# Altium schematic sheet PC_8OUT_V0.SchDoc
size A0
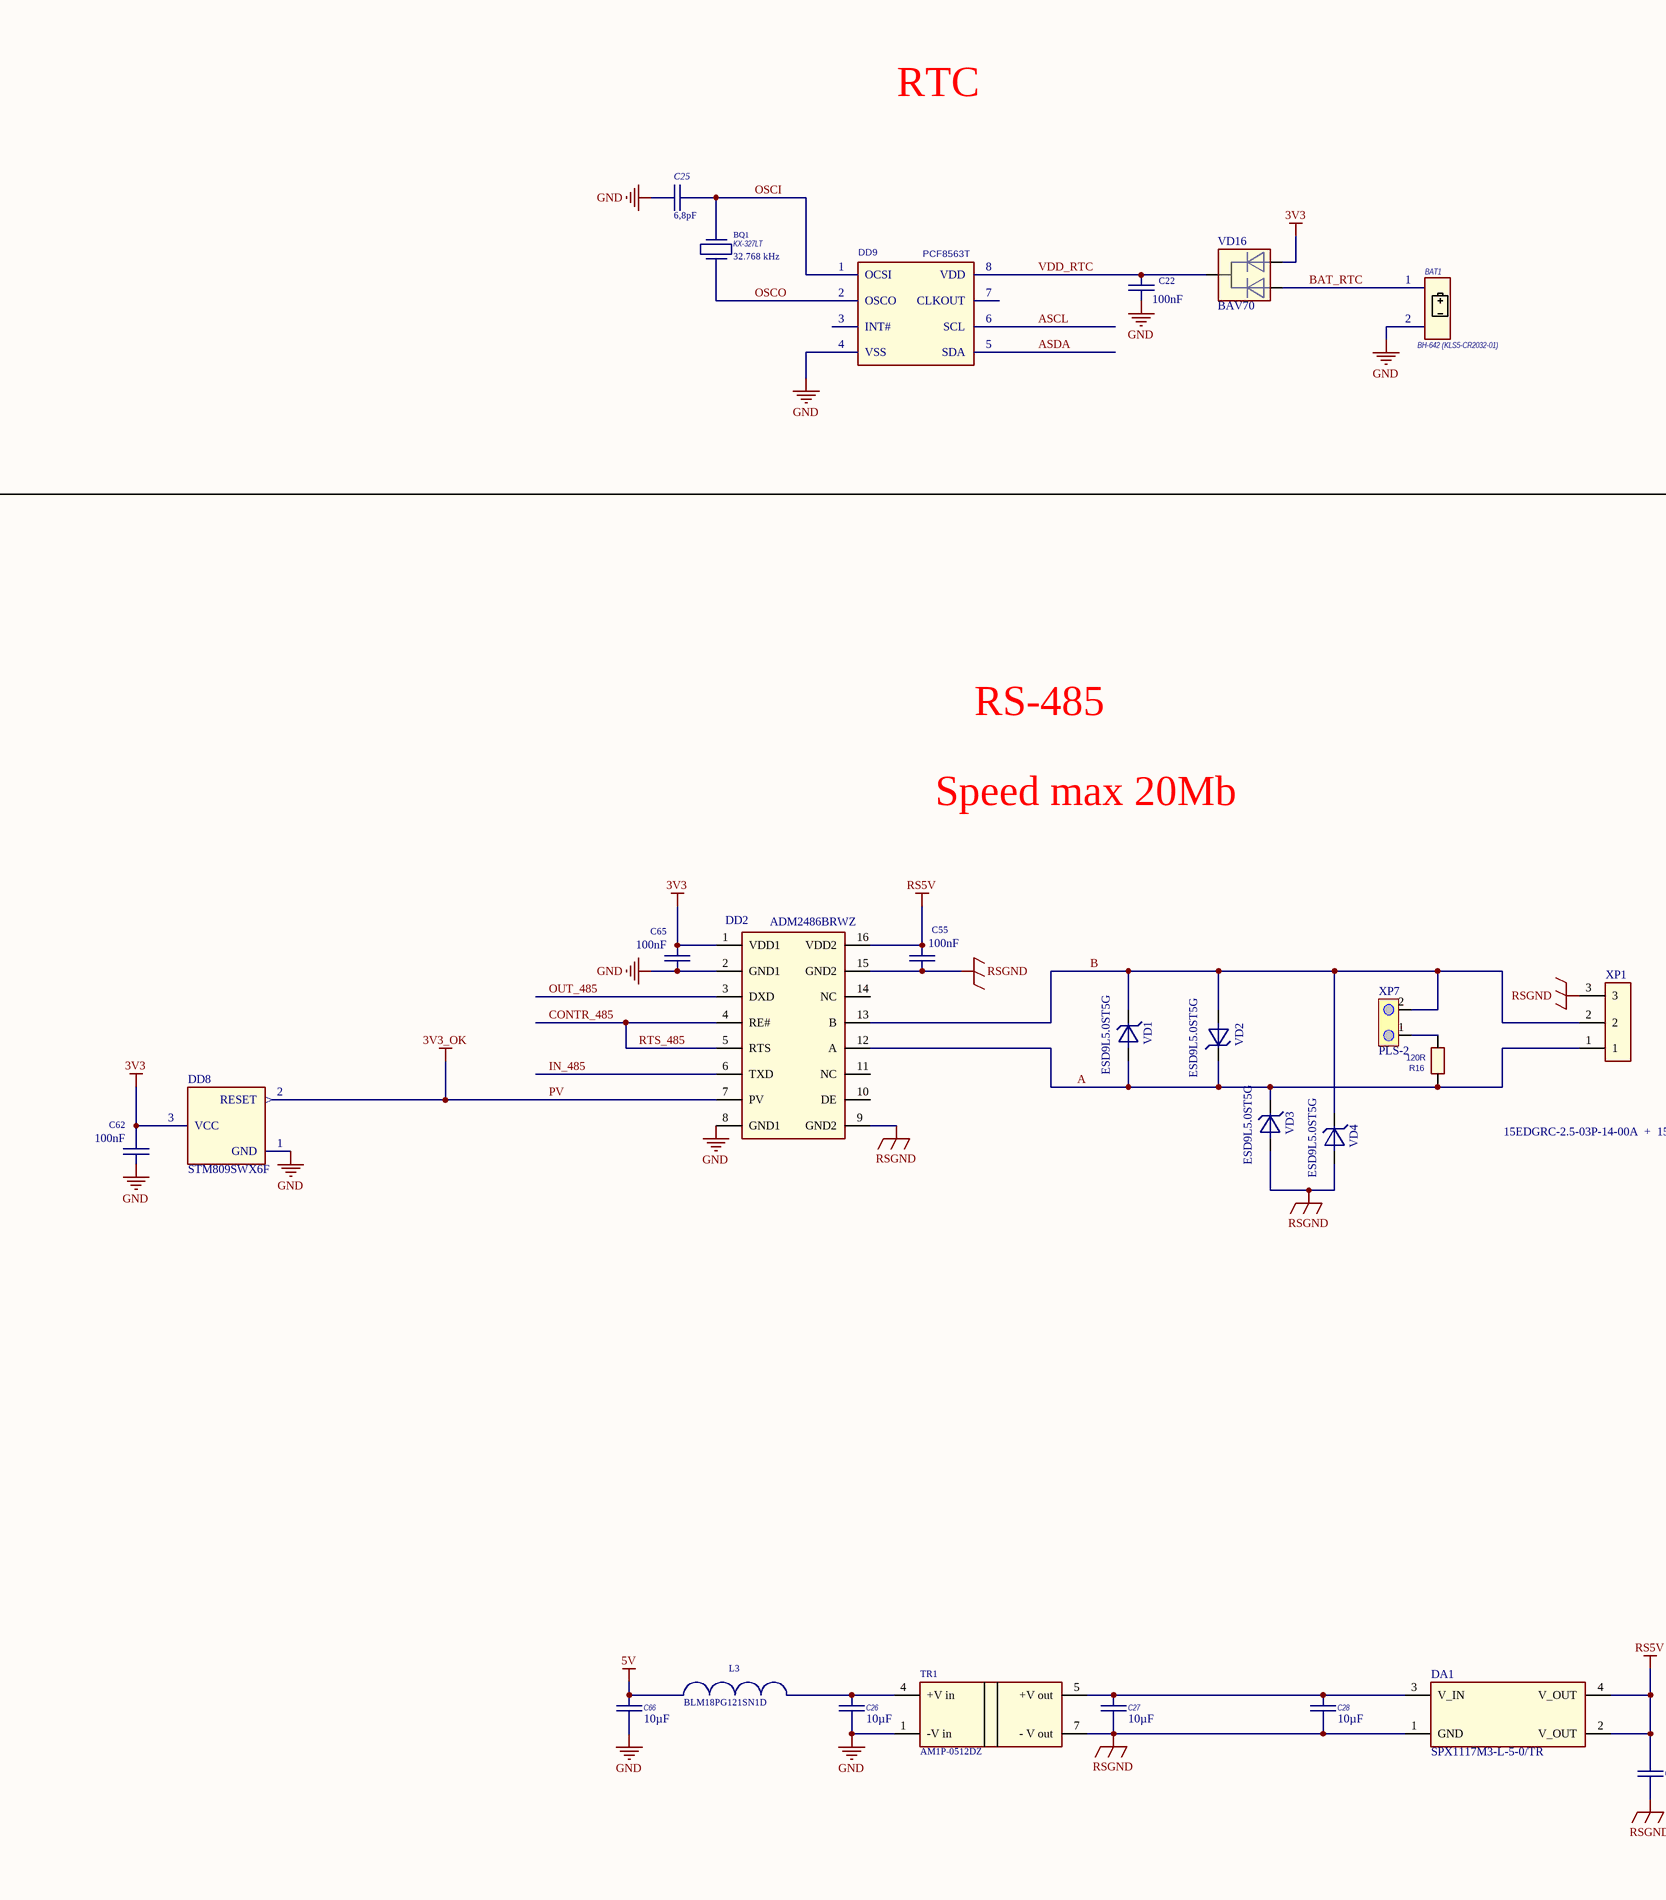
[diagram p0: PC_8OUT_V0.SchDoc, top left]
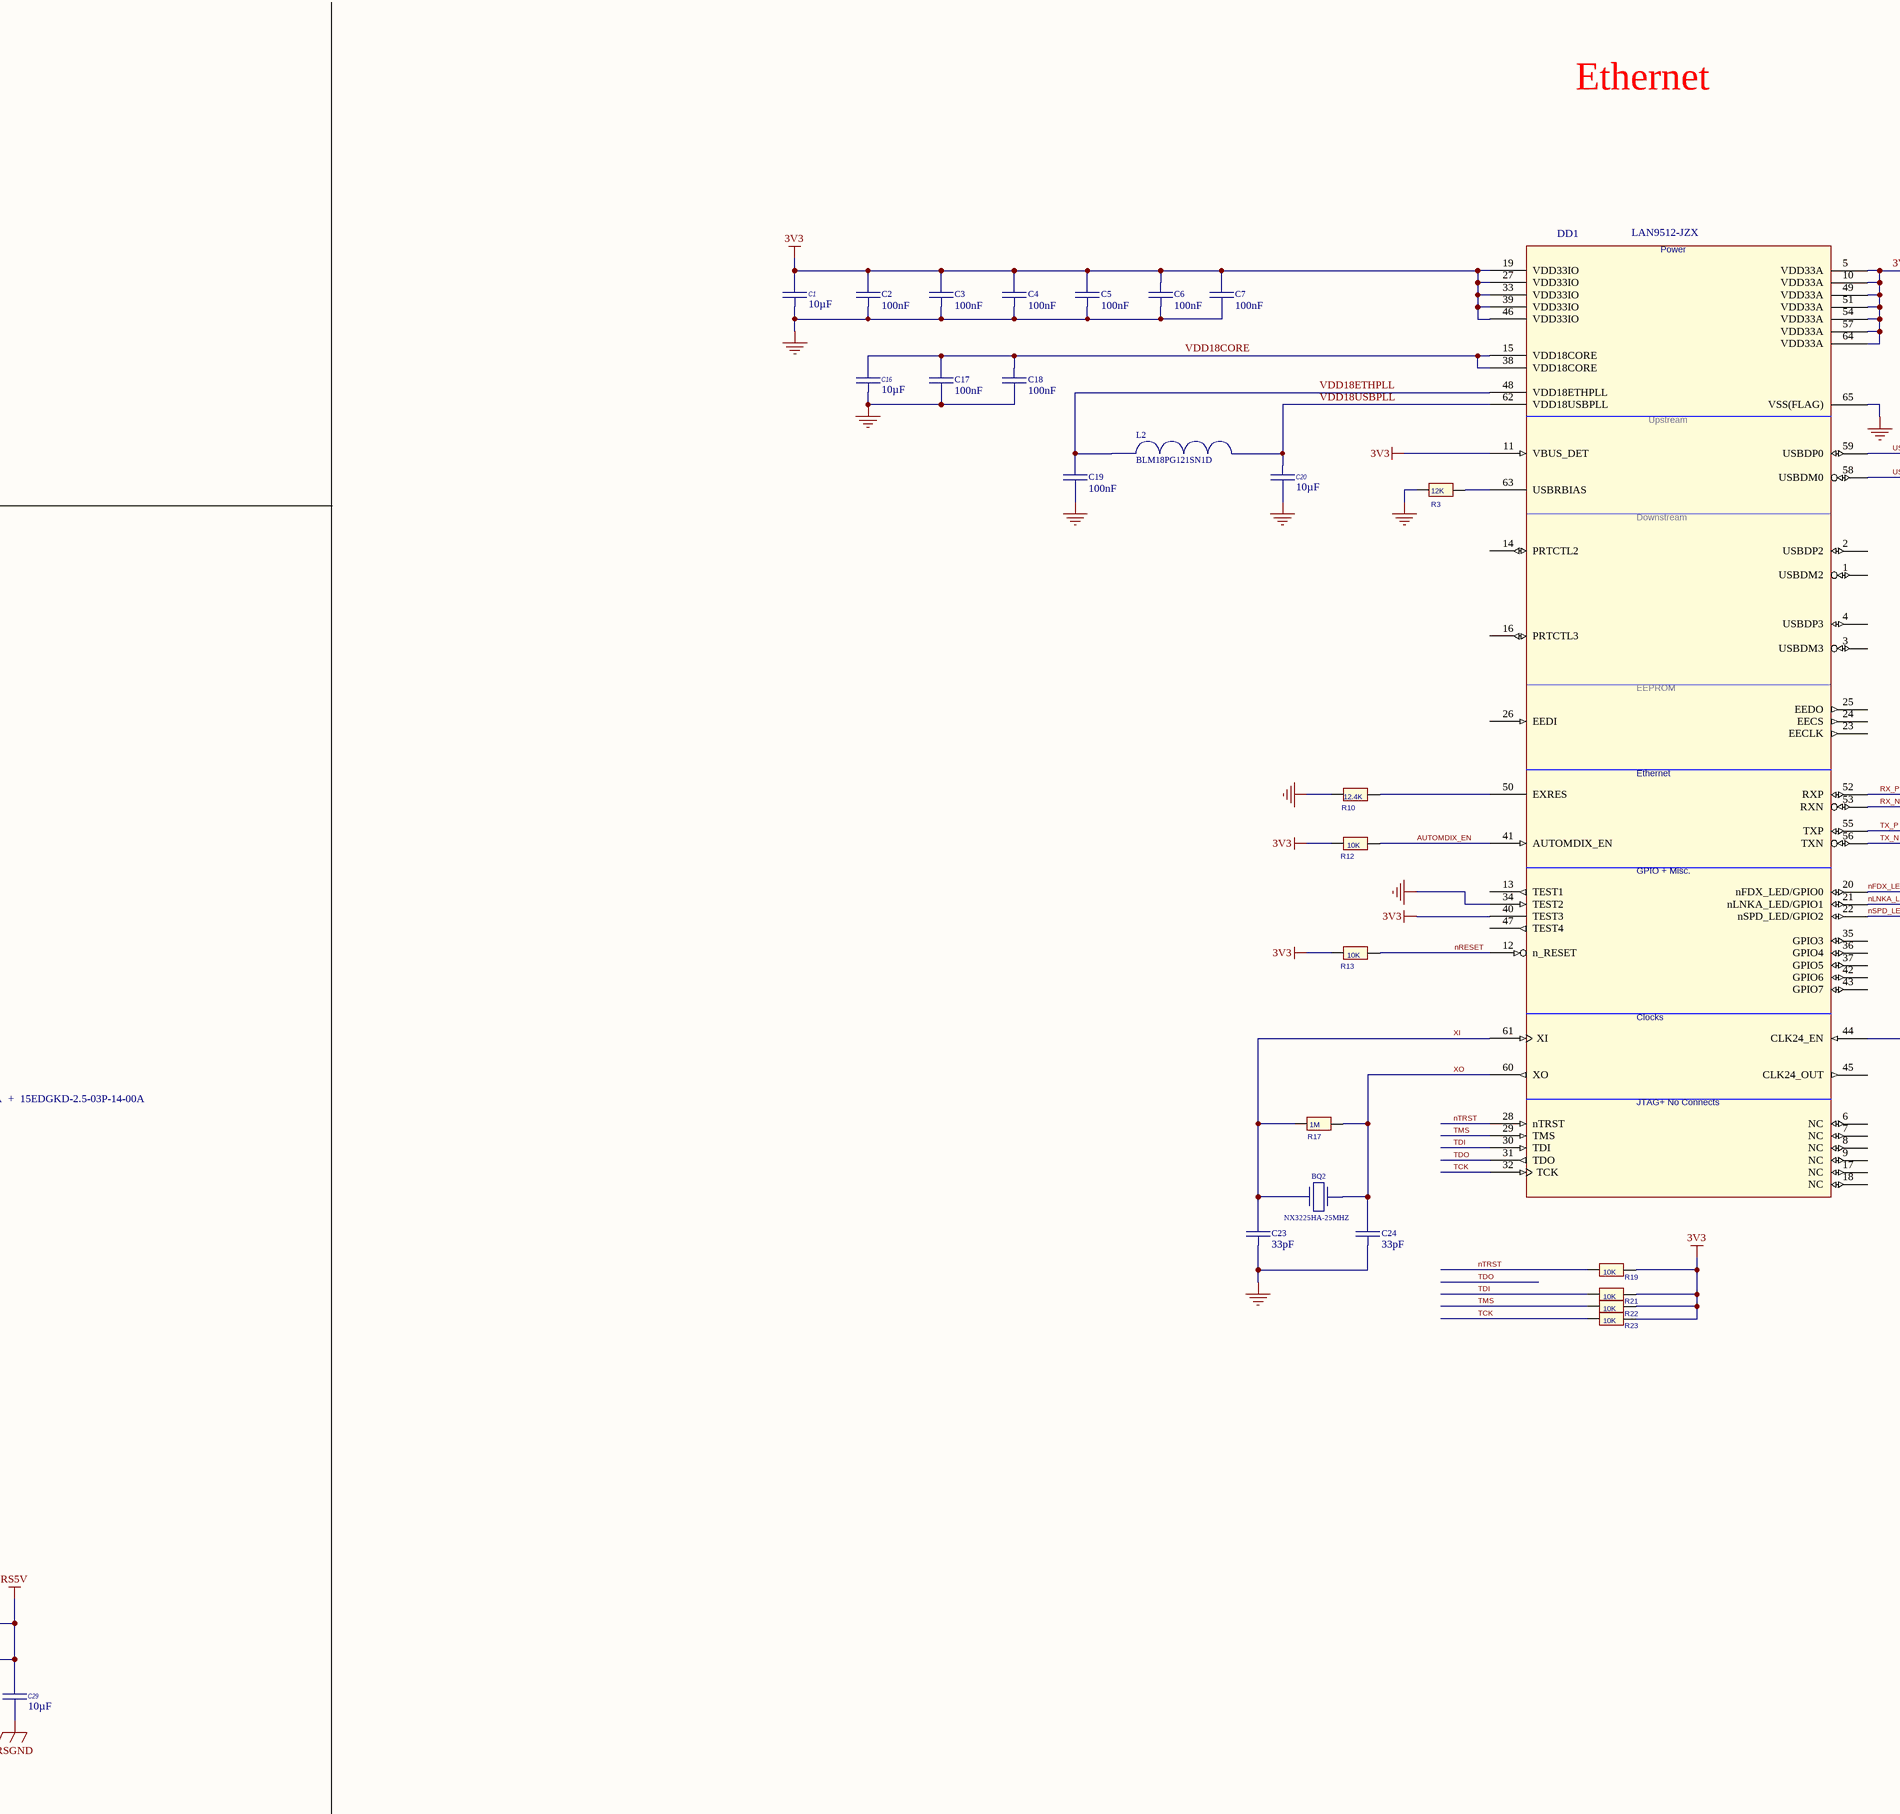
[diagram p1: PC_8OUT_V0.SchDoc, top middle]
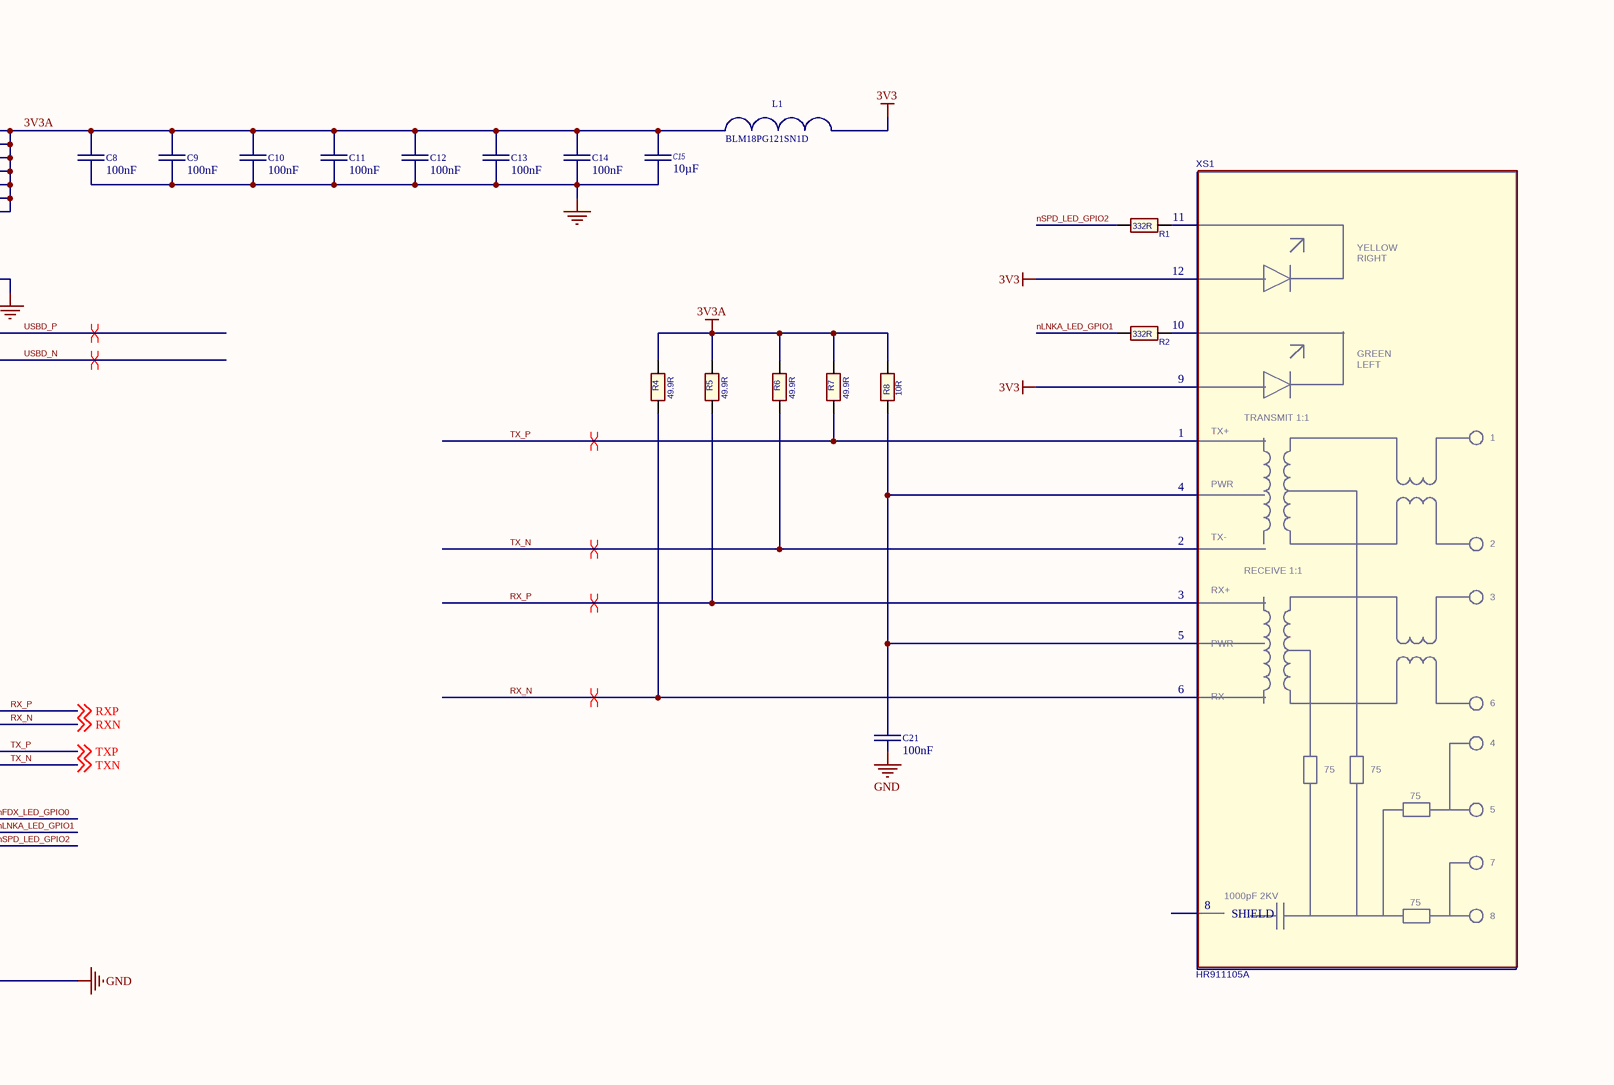
[diagram p2: PC_8OUT_V0.SchDoc, top right]
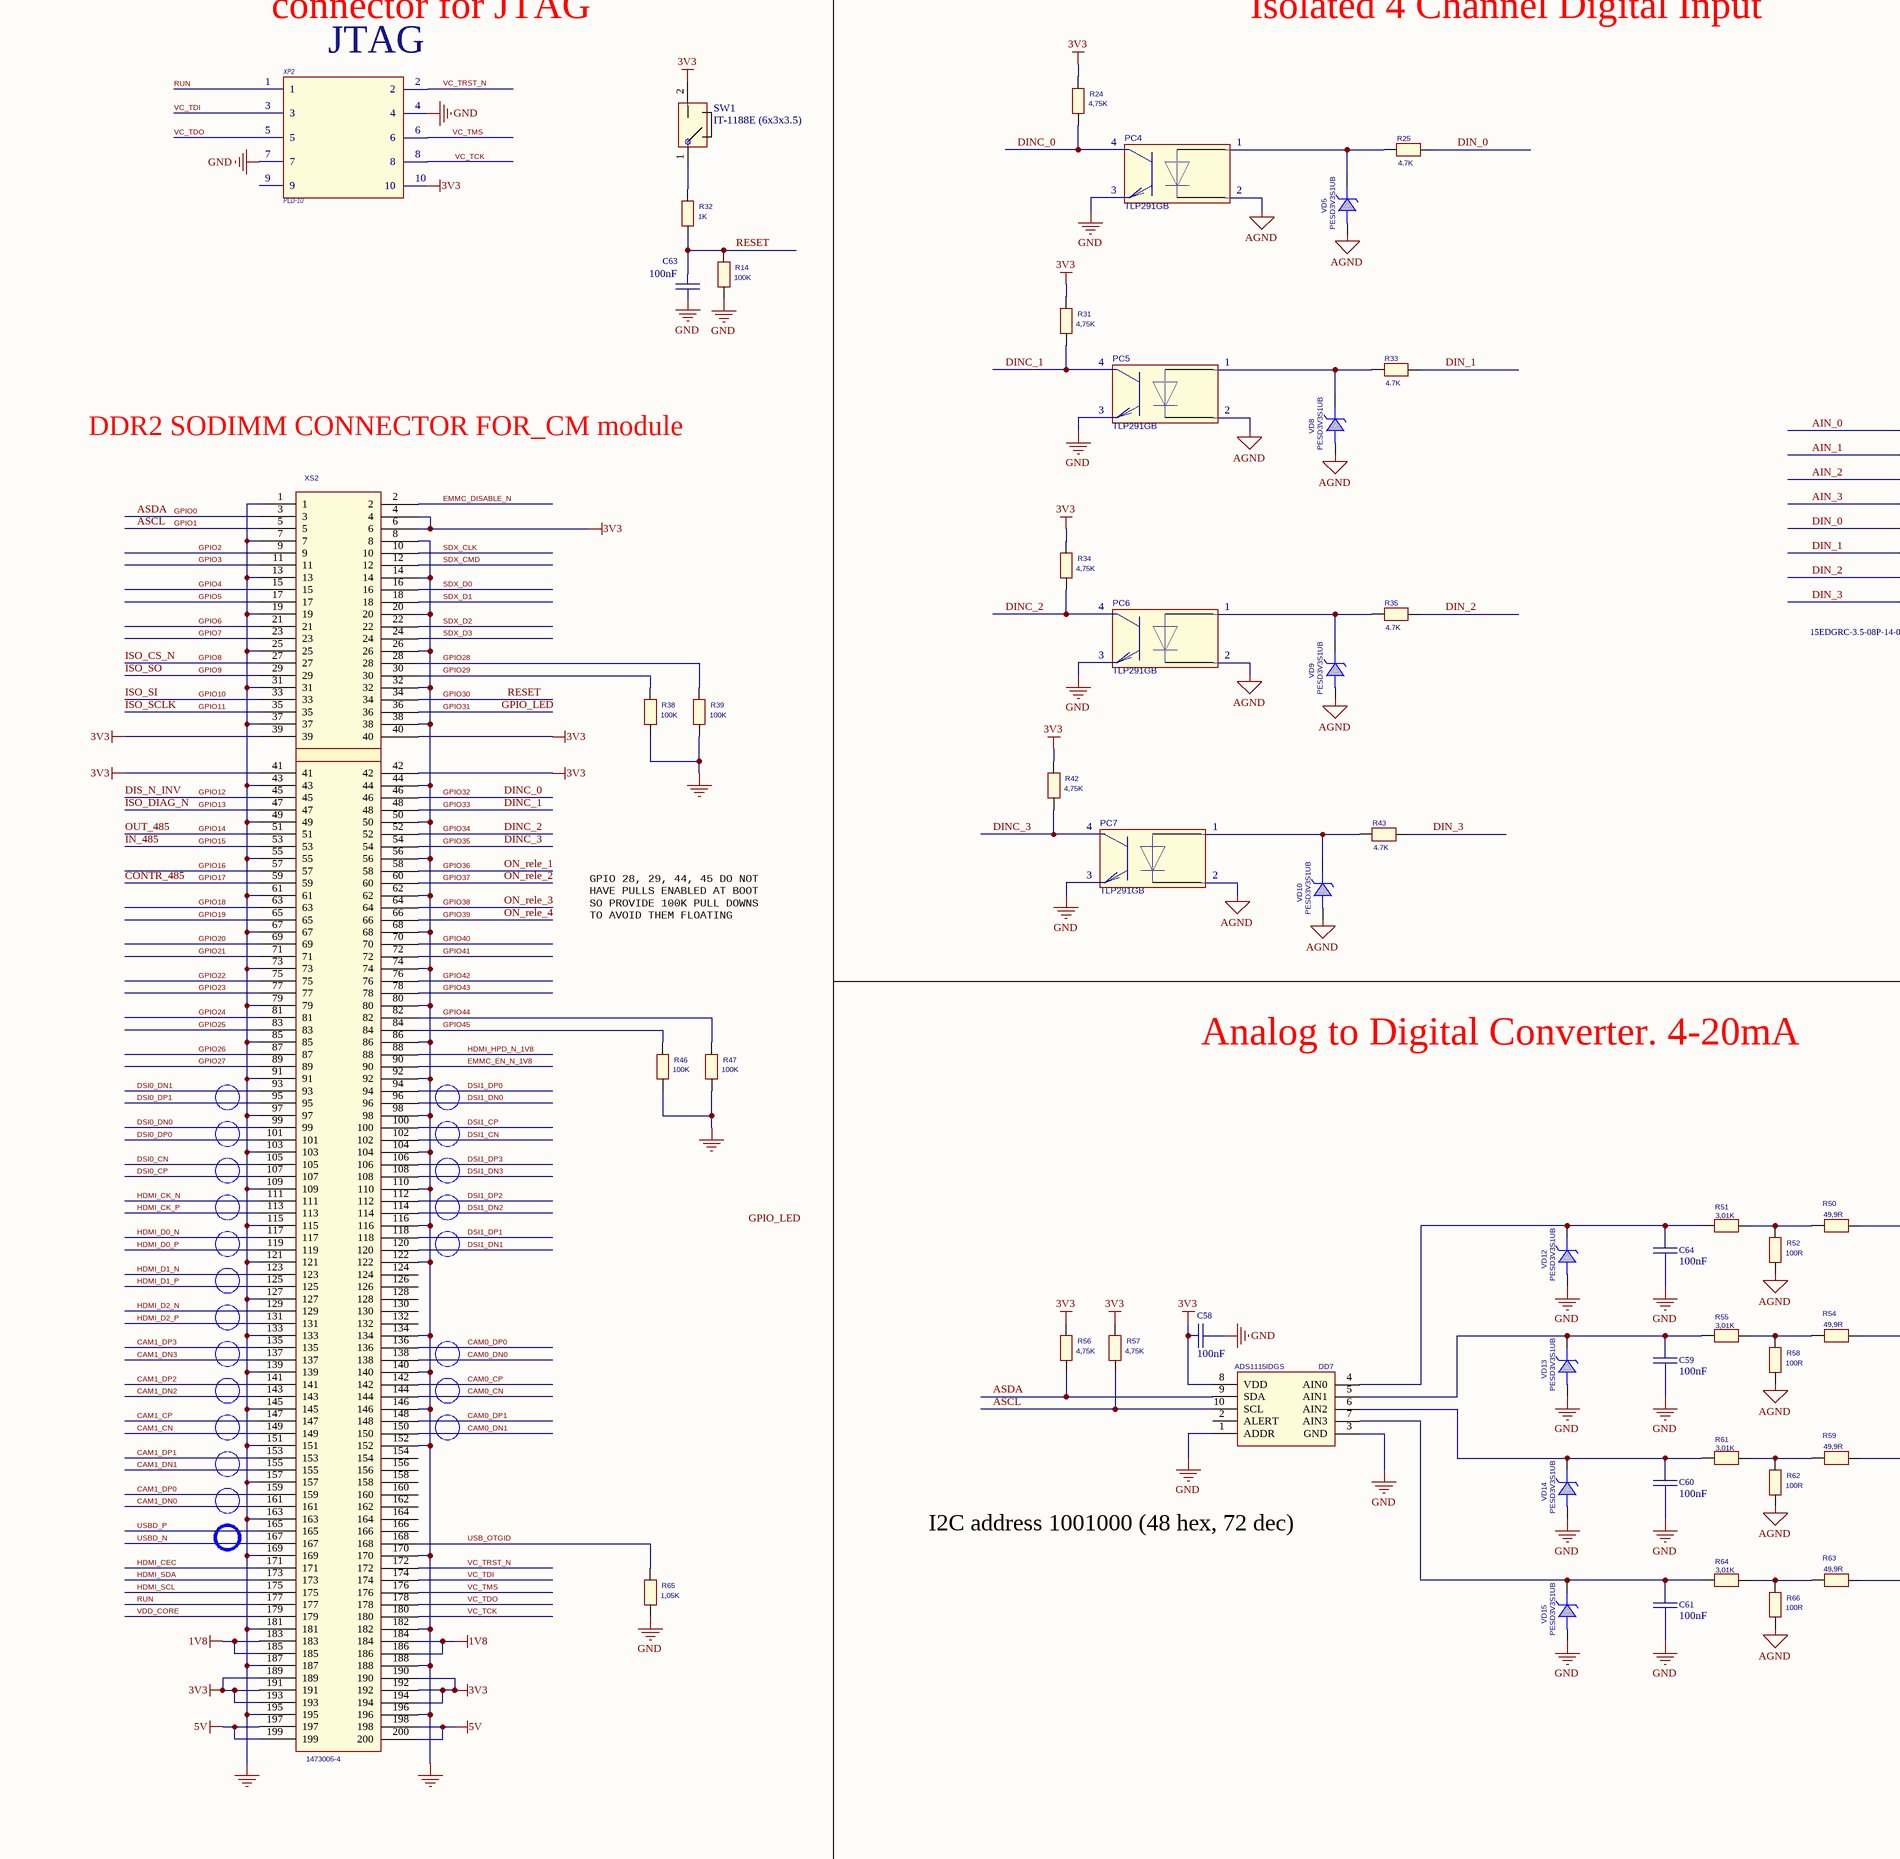
[diagram p3: PC_8OUT_V0.SchDoc, bottom left]
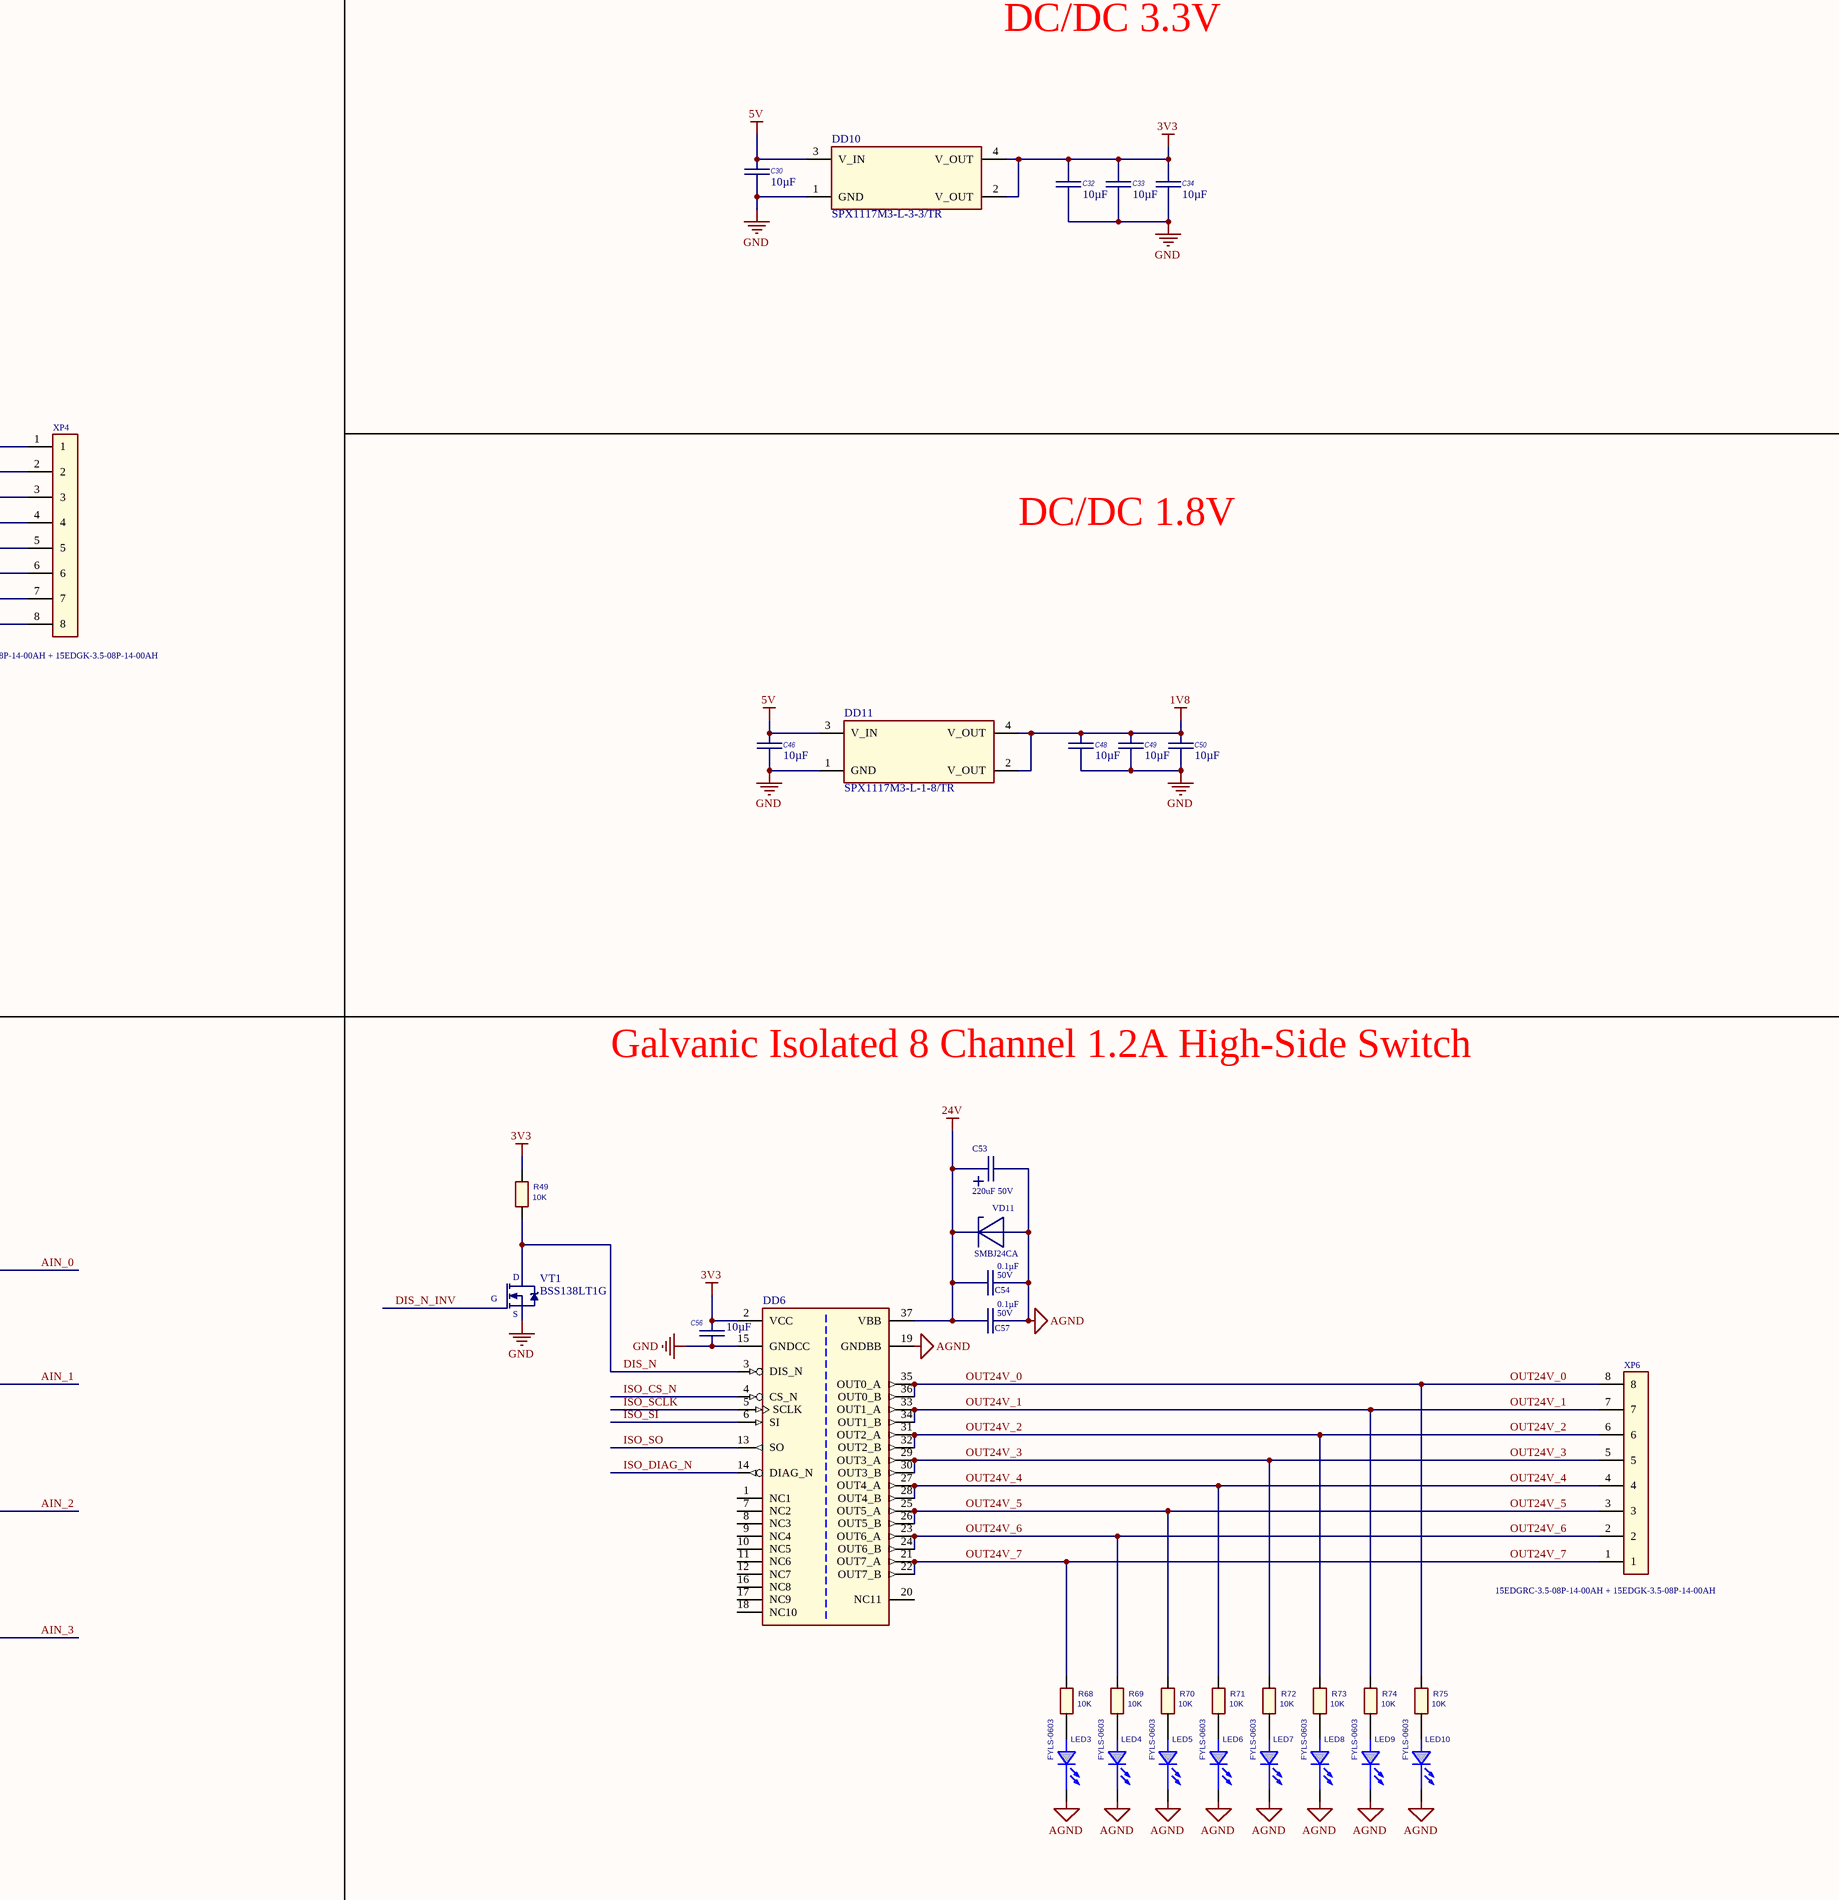
[diagram p4: PC_8OUT_V0.SchDoc, bottom middle]
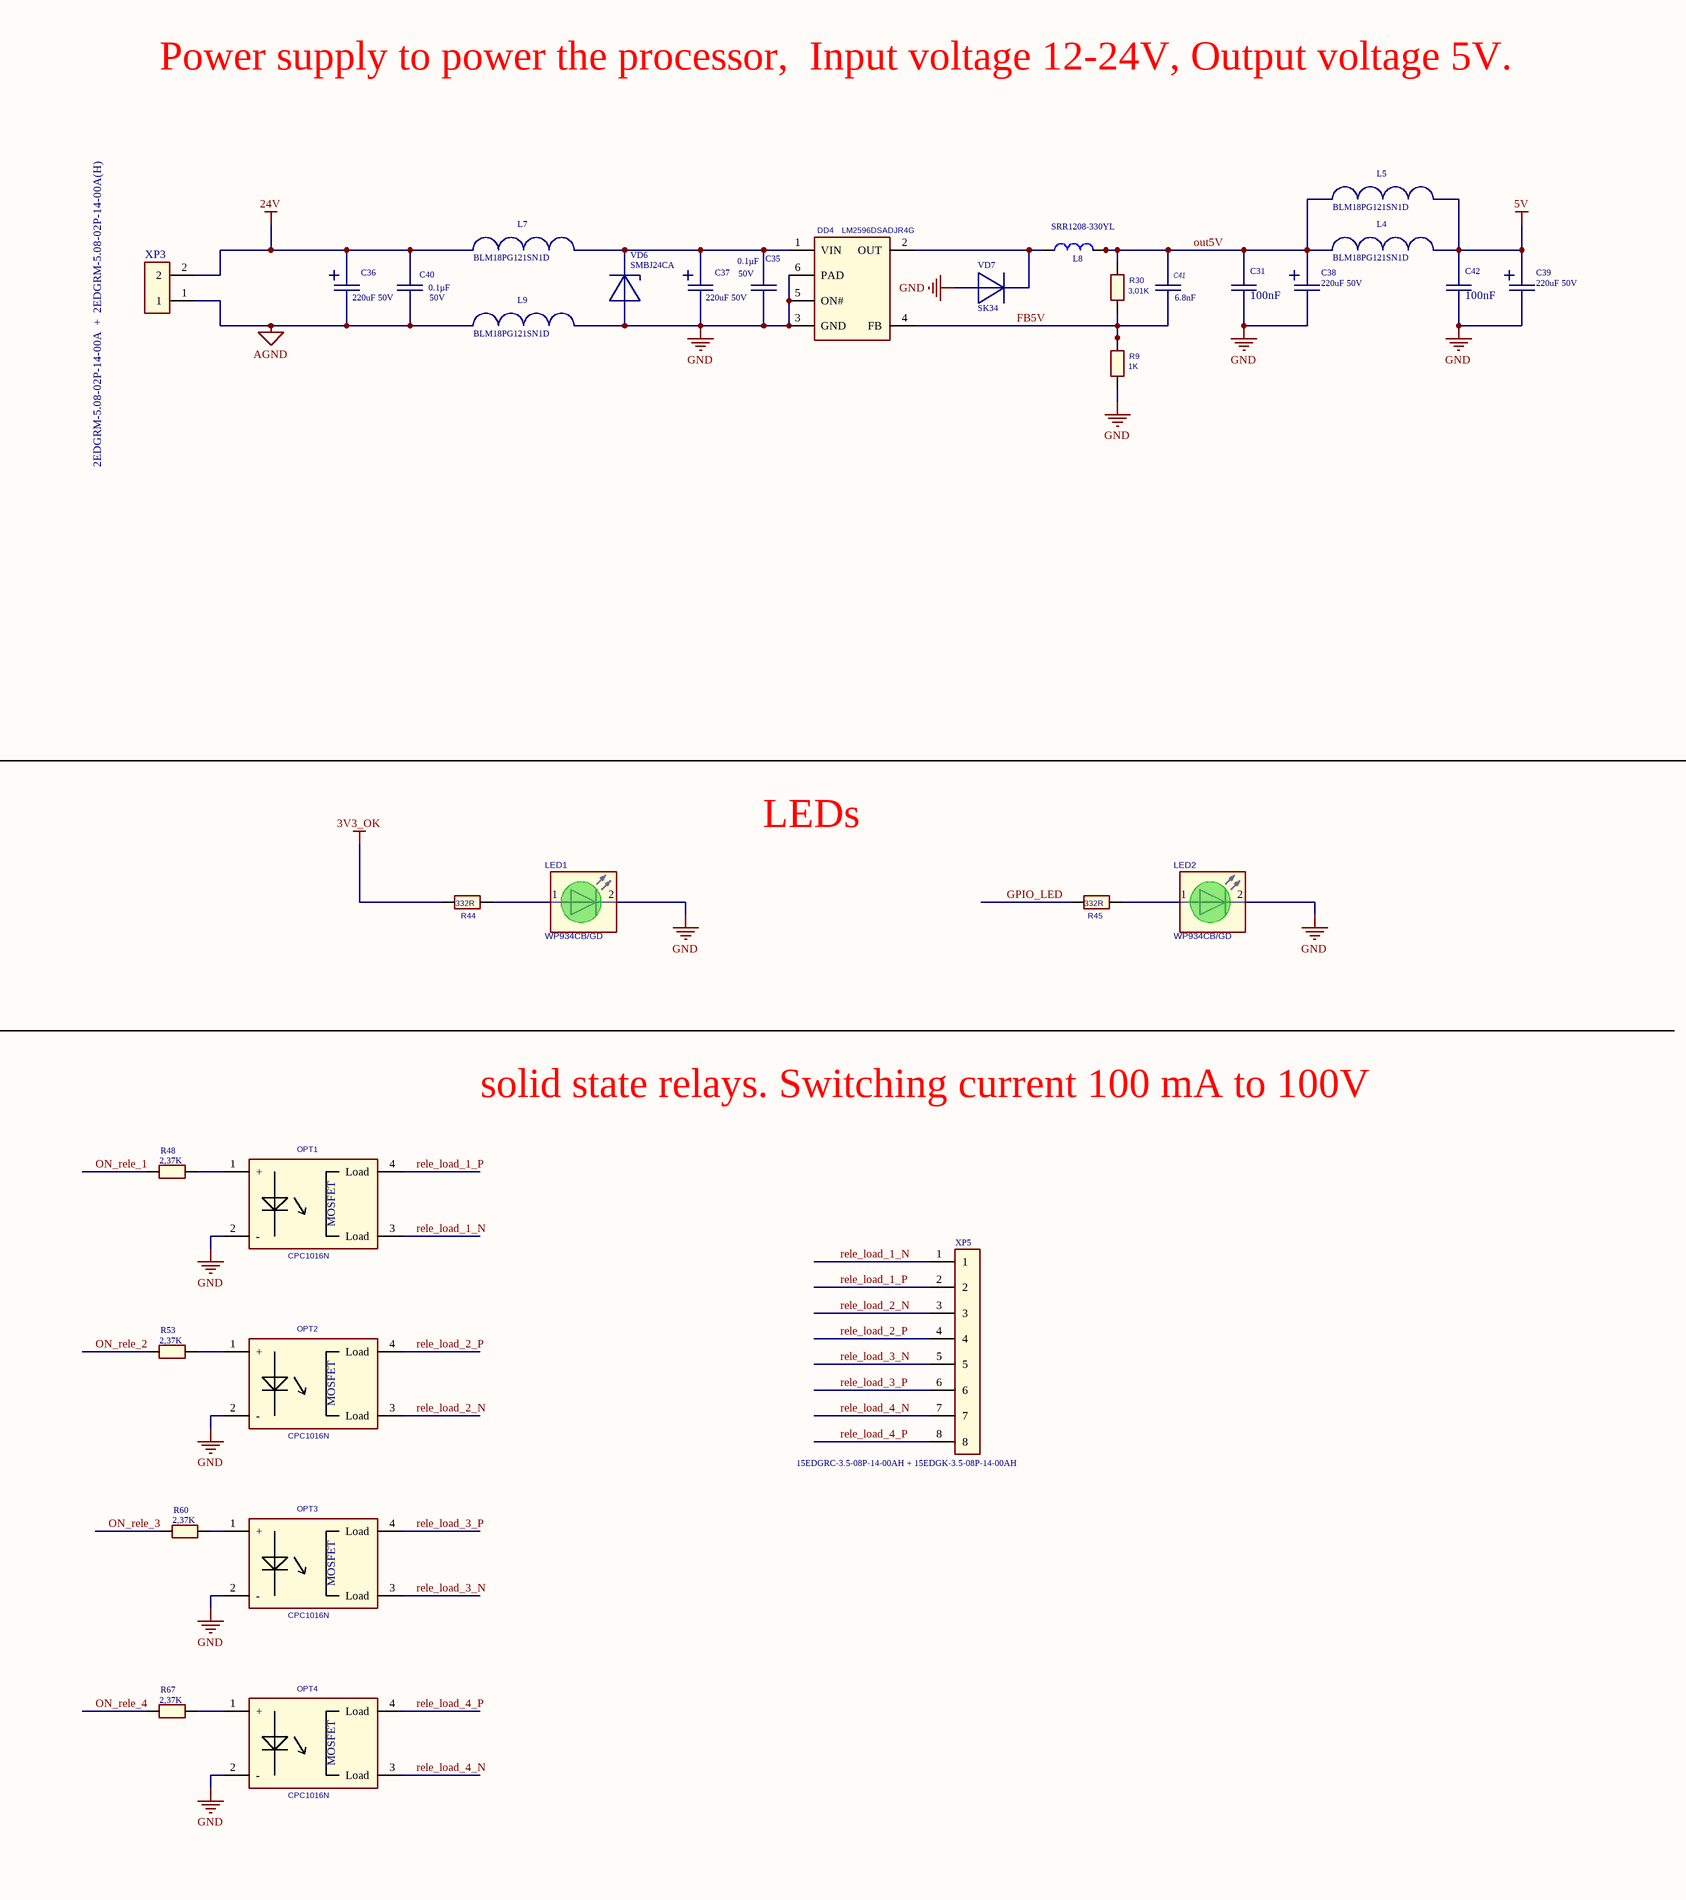
[diagram p5: PC_8OUT_V0.SchDoc, bottom right]

## Parts
BAT1  BH-642 (KLS5-CR2032-01)  [BAT_HOLD_2032]
BQ1  KX-327LT  [KX-327LT]
BQ2  NX3225HA-25MHZ  [3225]
C1  Capacitance: 10µF  [CAPC2012[0805]]  (hidden comment: GRM21BR61C106KE15)
C2  Capacitance: 100nF  [C0402_IPC High Density]  (hidden comment: GRM155R71C104KA88)
C3  Capacitance: 100nF  [C0402_IPC High Density]  (hidden comment: GRM155R71C104KA88)
C4  Capacitance: 100nF  [C0402_IPC High Density]  (hidden comment: GRM155R71C104KA88)
C5  Capacitance: 100nF  [C0402_IPC High Density]  (hidden comment: GRM155R71C104KA88)
C6  Capacitance: 100nF  [C0402_IPC High Density]  (hidden comment: GRM155R71C104KA88)
C7  Capacitance: 100nF  [C0402_IPC High Density]  (hidden comment: GRM155R71C104KA88)
C8  Capacitance: 100nF  [C0402_IPC High Density]  (hidden comment: GRM155R71C104KA88)
C9  Capacitance: 100nF  [C0402_IPC High Density]  (hidden comment: GRM155R71C104KA88)
C10  Capacitance: 100nF  [C0402_IPC High Density]  (hidden comment: GRM155R71C104KA88)
C11  Capacitance: 100nF  [C0402_IPC High Density]  (hidden comment: GRM155R71C104KA88)
C12  Capacitance: 100nF  [C0402_IPC High Density]  (hidden comment: GRM155R71C104KA88)
C13  Capacitance: 100nF  [C0402_IPC High Density]  (hidden comment: GRM155R71C104KA88)
C14  Capacitance: 100nF  [C0402_IPC High Density]  (hidden comment: GRM155R71C104KA88)
C15  Capacitance: 10µF  [CAPC2012[0805]]  (hidden comment: GRM21BR61C106KE15)
C16  Capacitance: 10µF  [CAPC2012[0805]]  (hidden comment: GRM21BR61C106KE15)
C17  Capacitance: 100nF  [C0402_IPC High Density]  (hidden comment: GRM155R71C104KA88)
C18  Capacitance: 100nF  [C0402_IPC High Density]  (hidden comment: GRM155R71C104KA88)
C19  Capacitance: 100nF  [C0402_IPC High Density]  (hidden comment: GRM155R71C104KA88)
C20  Capacitance: 10µF  [CAPC2012[0805]]  (hidden comment: GRM21BR61C106KE15)
C21  Capacitance: 100nF  [C0402_IPC High Density]  (hidden comment: GRM155R71C104KA88)
C22  Capacitance: 100nF  [C0402_IPC High Density]  (hidden comment: GRM155R71C104KA88)
C23  Capacitance: 33pF  [C0402_IPC High Density]  (hidden comment: C0402, 33pF, 50V, C0G)
C24  Capacitance: 33pF  [C0402_IPC High Density]  (hidden comment: C0402, 33pF, 50V, C0G)
C25  Capacitance: 6,8pF  [C0402_IPC High Density]  (hidden comment: C0402, 6.8pF,  50V, C0G)
C26  Capacitance: 10µF  [CAPC2012[0805]]  (hidden comment: GRM21BR61C106KE15)
C27  Capacitance: 10µF  [CAPC2012[0805]]  (hidden comment: GRM21BR61C106KE15)
C28  Capacitance: 10µF  [CAPC2012[0805]]  (hidden comment: GRM21BR61C106KE15)
C29  Capacitance: 10µF  [CAPC2012[0805]]  (hidden comment: GRM21BR61C106KE15)
C30  Capacitance: 10µF  [CAPC2012[0805]]  (hidden comment: GRM21BR61C106KE15)
C31  Capacitance: 100nF  [C0402_IPC High Density]  (hidden comment: GRM155R71C104KA88)
C32  Capacitance: 10µF  [CAPC2012[0805]]  (hidden comment: GRM21BR61C106KE15)
C33  Capacitance: 10µF  [CAPC2012[0805]]  (hidden comment: GRM21BR61C106KE15)
C34  Capacitance: 10µF  [CAPC2012[0805]]  (hidden comment: GRM21BR61C106KE15)
C35  Capacitance: 0.1µF  Voltage - Rated: 50V  [1206]  (hidden comment: C1206C104K5RAC7800)
C36  CA050M0220REG-1010  [CAP SMD 1010]  (value not drawn)
C37  CA050M0220REG-1010  [CAP SMD 1010]  (value not drawn)
C38  CA050M0220REG-1010  [CAP SMD 1010]  (value not drawn)
C39  CA050M0220REG-1010  [CAP SMD 1010]  (value not drawn)
C40  Capacitance: 0.1µF  Voltage - Rated: 50V  [1206]  (hidden comment: C1206C104K5RAC7800)
C41  Capacitance: 6.8nF  [C0402_IPC High Density]  (hidden comment: GRM155R71E682KA01)
C42  Capacitance: 100nF  [C0402_IPC High Density]  (hidden comment: GRM155R71C104KA88)
C46  Capacitance: 10µF  [CAPC2012[0805]]  (hidden comment: GRM21BR61C106KE15)
C48  Capacitance: 10µF  [CAPC2012[0805]]  (hidden comment: GRM21BR61C106KE15)
C49  Capacitance: 10µF  [CAPC2012[0805]]  (hidden comment: GRM21BR61C106KE15)
C50  Capacitance: 10µF  [CAPC2012[0805]]  (hidden comment: GRM21BR61C106KE15)
C53  CA050M0220REG-1010  [CAP SMD 1010]  (value not drawn)
C54  Capacitance: 0.1µF  Voltage - Rated: 50V  [1206]  (hidden comment: C1206C104K5RAC7800)
C55  Capacitance: 100nF  [C0402_IPC High Density]  (hidden comment: GRM155R71C104KA88)
C56  Capacitance: 10µF  [CAPC2012[0805]]  (hidden comment: GRM21BR61C106KE15)
C57  Capacitance: 0.1µF  Voltage - Rated: 50V  [1206]  (hidden comment: C1206C104K5RAC7800)
C58  Capacitance: 100nF  [C0402_IPC High Density]  (hidden comment: GRM155R71C104KA88)
C59  Capacitance: 100nF  [C0402_IPC High Density]  (hidden comment: GRM155R71C104KA88)
C60  Capacitance: 100nF  [C0402_IPC High Density]  (hidden comment: GRM155R71C104KA88)
C61  Capacitance: 100nF  [C0402_IPC High Density]  (hidden comment: GRM155R71C104KA88)
C62  Capacitance: 100nF  [C0402_IPC High Density]  (hidden comment: GRM155R71C104KA88)
C63  Capacitance: 100nF  [C0402_IPC High Density]  (hidden comment: GRM155R71C104KA88)
C64  Capacitance: 100nF  [C0402_IPC High Density]  (hidden comment: GRM155R71C104KA88)
C65  Capacitance: 100nF  [C0402_IPC High Density]  (hidden comment: GRM155R71C104KA88)
C66  Capacitance: 10µF  [CAPC2012[0805]]  (hidden comment: GRM21BR61C106KE15)
DA1  SPX1117M3-L-5-0/TR  [SOT223_N]
DD1  LAN9512-JZX  [QFN64_9X9MM_EP7P3MM]
DD2  ADM2486BRWZ  [SOIC 16 (300-mil Body Width)]
DD4  LM2596DSADJR4G  [D2PAK (TO-263-5)]
DD6  ISO1H816G  [SOP65P1420X350-37N-1-V]  (value not drawn)
DD7  ADS1115IDGS  [VSSOP10]
DD8  STM809SWX6F  [SOT-23]
DD9  PCF8563T  [SO-8_L]
DD10  SPX1117M3-L-3-3/TR  [SOT223_N]
DD11  SPX1117M3-L-1-8/TR  [SOT223_N]
L1  BLM18PG121SN1D  [INDC1608X95N]
L2  BLM18PG121SN1D  [INDC1608X95N]
L3  BLM18PG121SN1D  [INDC1608X95N]
L4  BLM18PG121SN1D  [INDC1608X95N]
L5  BLM18PG121SN1D  [INDC1608X95N]
L7  BLM18PG121SN1D  [INDC1608X95N]
L8  SRR1208-330YL  [SRR1208]
L9  BLM18PG121SN1D  [INDC1608X95N]
LED1  WP934CB/GD  [L-934SB/4GD]
LED2  WP934CB/GD  [L-934SB/4GD]
LED3  FYLS-0603  [LED 0603 (1.6X0.8X0.8)]
LED4  FYLS-0603  [LED 0603 (1.6X0.8X0.8)]
LED5  FYLS-0603  [LED 0603 (1.6X0.8X0.8)]
LED6  FYLS-0603  [LED 0603 (1.6X0.8X0.8)]
LED7  FYLS-0603  [LED 0603 (1.6X0.8X0.8)]
LED8  FYLS-0603  [LED 0603 (1.6X0.8X0.8)]
LED9  FYLS-0603  [LED 0603 (1.6X0.8X0.8)]
LED10  FYLS-0603  [LED 0603 (1.6X0.8X0.8)]
OPT1  CPC1016N  [SOP4]
OPT2  CPC1016N  [SOP4]
OPT3  CPC1016N  [SOP4]
OPT4  CPC1016N  [SOP4]
PC4  TLP291GB  [TLP292]
PC5  TLP291GB  [TLP292]
PC6  TLP291GB  [TLP292]
PC7  TLP291GB  [TLP292]
R1  332R  [RESC1005[0402]]
R2  332R  [RESC1005[0402]]
R3  12K  [RESC1005[0402]]
R4  49.9R  [RESC1005[0402]]
R5  49.9R  [RESC1005[0402]]
R6  49.9R  [RESC1005[0402]]
R7  49.9R  [RESC1005[0402]]
R8  10R  [RESC1005[0402]]
R9  1K  [RESC1005[0402]]
R10  12.4K  [RESC1005[0402]]
R12  10K  [RESC1005[0402]]
R13  10K  [RESC1005[0402]]
R14  100K  [RESC1005[0402]]
R16  120R  [RESC1005[0402]]
R17  1M  [RESC1005[0402]]
R19  10K  [RESC1005[0402]]
R21  10K  [RESC1005[0402]]
R22  10K  [RESC1005[0402]]
R23  10K  [RESC1005[0402]]
R24  4,75K  [RESC1005[0402]]
R25  4.7K  [R0805]
R30  3,01K  [RESC1005[0402]]
R31  4,75K  [RESC1005[0402]]
R32  1K  [RESC1005[0402]]
R33  4.7K  [R0805]
R34  4,75K  [RESC1005[0402]]
R35  4.7K  [R0805]
R38  100K  [RESC1005[0402]]
R39  100K  [RESC1005[0402]]
R42  4,75K  [RESC1005[0402]]
R43  4.7K  [R0805]
R44  332R  [RESC1005[0402]]
R45  332R  [RESC1005[0402]]
R46  100K  [RESC1005[0402]]
R47  100K  [RESC1005[0402]]
R48  2,37K  [RESC1005[0402]]
R49  10K  [RESC1005[0402]]
R50  49,9R  [RESC1005[0402]]
R51  3,01K  [RESC1005[0402]]
R52  100R  [RESC1005[0402]]
R53  2,37K  [RESC1005[0402]]
R54  49,9R  [RESC1005[0402]]
R55  3,01K  [RESC1005[0402]]
R56  4,75K  [RESC1005[0402]]
R57  4,75K  [RESC1005[0402]]
R58  100R  [RESC1005[0402]]
R59  49,9R  [RESC1005[0402]]
R60  2,37K  [RESC1005[0402]]
R61  3,01K  [RESC1005[0402]]
R62  100R  [RESC1005[0402]]
R63  49,9R  [RESC1005[0402]]
R64  3,01K  [RESC1005[0402]]
R65  1,05K  [RESC1005[0402]]
R66  100R  [RESC1005[0402]]
R67  2,37K  [RESC1005[0402]]
R68  10K  [RESC1005[0402]]
R69  10K  [RESC1005[0402]]
R70  10K  [RESC1005[0402]]
R71  10K  [RESC1005[0402]]
R72  10K  [RESC1005[0402]]
R73  10K  [RESC1005[0402]]
R74  10K  [RESC1005[0402]]
R75  10K  [RESC1005[0402]]
SW1  IT-1188E (6x3x3.5)  [IT-1188E (6x3x3.5)]
TR1  AM1P-0512DZ  [AM1P-Z]
VD1  ESD9L5.0ST5G  [SOD-923]
VD2  ESD9L5.0ST5G  [SOD-923]
VD3  ESD9L5.0ST5G  [SOD-923]
VD4  ESD9L5.0ST5G  [SOD-923]
VD5  PESD3V3S1UB  [SOD-523]
VD6  SMBJ24CA  [SMB]
VD7  SK34  [SMC]
VD8  PESD3V3S1UB  [SOD-523]
VD9  PESD3V3S1UB  [SOD-523]
VD10  PESD3V3S1UB  [SOD-523]
VD11  SMBJ24CA  [SMB]
VD12  PESD3V3S1UB  [SOD-523]
VD13  PESD3V3S1UB  [SOD-523]
VD14  PESD3V3S1UB  [SOD-523]
VD15  PESD3V3S1UB  [SOD-523]
VD16  BAV70  [SOT-23]
VT1  BSS138LT1G  [SOT-23]
XP1  15EDGRC-2.5-03P-14-00A  +  15EDGKD-2.5-03P-14-00A  [15EDGRC-2.5-03P-14-00A(H)]
XP2  PLD-10  [PLD-10]
XP3  2EDGRM-5.08-02P-14-00A  +  2EDGRM-5.08-02P-14-00A(H)  [2EDGRM-5.08-02P-14-00A]
XP4  15EDGRC-3.5-08P-14-00AH + 15EDGK-3.5-08P-14-00AH  [15EDGRC-3.5-06P-14-00AH]
XP5  15EDGRC-3.5-08P-14-00AH + 15EDGK-3.5-08P-14-00AH  [15EDGRC-3.5-06P-14-00AH]
XP6  15EDGRC-3.5-08P-14-00AH + 15EDGK-3.5-08P-14-00AH  [15EDGRC-3.5-06P-14-00AH]
XP7  PLS-2  [PLS-2]
XS1  HR911105A  [HR911105A]
XS2  1473005-4  [1473005-4+RPI3 CM]

## Nets
1V8: C48.1 C49.1 C50.1 DD11.2(V_OUT) DD11.4(V_OUT) XS2.183 XS2.184 XS2.185 XS2.186
3V3: C1.2 C2.2 C3.2 C4.2 C5.2 C6.2 C7.2 C32.1 C33.1 C34.1 C56.2 C58.1 C62.2 C65.2 DD1.11(VBUS_DET) DD1.19(VDD33IO) DD1.27(VDD33IO) DD1.33(VDD33IO) DD1.39(VDD33IO) DD1.40(TEST3) DD1.46(VDD33IO) DD2.1(VDD1) DD6.2(VCC) DD7.8(VDD) DD8.3(VCC) DD10.2(V_OUT) DD10.4(V_OUT) L1.2 R12.1 R13.1 R19.2 R21.2 R22.2 R23.2 R24.1 R31.1 R34.1 R42.1 R49.1 R56.1 R57.1 SW1.2 VD16.2 XP2.10 XS1.9 XS1.12 XS2.4 XS2.6 XS2.39 XS2.40 XS2.41 XS2.42 XS2.189 XS2.190 XS2.191 XS2.192 XS2.193 XS2.194
3V3A: C8.2 C9.2 C10.2 C11.2 C12.2 C13.2 C14.2 C15.2 DD1.5(VDD33A) DD1.10(VDD33A) DD1.49(VDD33A) DD1.51(VDD33A) DD1.54(VDD33A) DD1.57(VDD33A) DD1.64(VDD33A) L1.1 R4.1 R5.1 R6.1 R7.1 R8.1
5V: C30.1 C39.2 C42.2 C46.1 C66.1 DD10.3(V_IN) DD11.3(V_IN) L3.1 L4.2 L5.2 XS2.197 XS2.198 XS2.199 XS2.200
24V: C36.2 C40.1 C53.2 C54.1 C57.1 DD6.37(VBB) L7.1 VD11.1 XP3.2
AGND: C36.1 C40.2 C53.1 C54.2 C57.2 DD6.19(GNDBB) L9.1 LED3.2(CATHODE) LED4.2(CATHODE) LED5.2(CATHODE) LED6.2(CATHODE) LED7.2(CATHODE) LED8.2(CATHODE) LED9.2(CATHODE) LED10.2(CATHODE) PC4.2 PC5.2 PC6.2 PC7.2 R52.2 R58.2 R62.2 R66.2 VD5.1 VD8.1 VD9.1 VD10.1 VD11.2 XP3.1
GND: BAT1.2 C1.1 C2.1 C3.1 C4.1 C5.1 C6.1 C7.1 C8.1 C9.1 C10.1 C11.1 C12.1 C13.1 C14.1 C15.1 C16.1 C17.1 C18.1 C19.1 C20.1 C21.1 C22.1 C23.1 C24.1 C25.2 C26.2 C30.2 C31.1 C32.2 C33.2 C34.2 C35.2 C37.1 C38.1 C39.1 C42.1 C46.2 C48.2 C49.2 C50.2 C56.1 C58.2 C59.1 C60.1 C61.1 C62.1 C63.1 C64.1 C65.1 C66.2 DD1.34(TEST2) DD1.44(CLK24_EN) DD1.65(VSS(FLAG)) DD2.2(GND1) DD2.8(GND1) DD4.3(GND) DD4.5(ON#) DD4.6(PAD) DD6.15(GNDCC) DD7.1(ADDR) DD7.3(GND) DD8.1(GND) DD9.4(VSS) DD10.1(GND) DD11.1(GND) L9.2 LED1.2 LED2.2 OPT1.2(-) OPT2.2(-) OPT3.2(-) OPT4.2(-) PC4.3 PC5.3 PC6.3 PC7.3 R3.1 R9.2 R10.1 R14.2 R38.2 R39.2 R46.2 R47.2 R65.2 TR1.1(-V_in) VD6.2 VD7.2 VD12.1 VD13.1 VD14.1 VD15.1 VT1.2(S) XP2.4 XP2.7 XS2.1 XS2.7 XS2.8 XS2.13 XS2.14 XS2.19 XS2.20 XS2.25 XS2.26 XS2.31 XS2.32 XS2.37 XS2.38 XS2.43 XS2.44 XS2.49 XS2.50 XS2.55 XS2.56 XS2.61 XS2.62 XS2.67 XS2.68 XS2.73 XS2.74 XS2.79 XS2.80 XS2.85 XS2.86 XS2.91 XS2.92 XS2.97 XS2.98 XS2.103 XS2.104 XS2.109 XS2.110 XS2.115 XS2.116 XS2.121 XS2.122 XS2.127 XS2.133 XS2.134 XS2.139 XS2.140 XS2.145 XS2.146 XS2.151 XS2.152 XS2.157 XS2.163 XS2.169 XS2.170 XS2.181 XS2.182 XS2.187 XS2.188 XS2.195 XS2.196
PV: DD2.7(PV) DD8.2(RESET) R44.1  [also labelled 3V3_OK]
RS5V: C29.1 C55.2 DA1.2(V_OUT) DA1.4(V_OUT) DD2.16(VDD2)
RSGND: C27.2 C28.2 C29.2 C55.1 DA1.1(GND) DD2.9(GND2) DD2.15(GND2) TR1.7(-_V_out) VD3.2 VD4.2 XP1.3
A: DD2.12(A) R16.1 VD1.2 VD2.1 VD3.1 XP1.1
AIN_0: R50.2 XP4.1
AIN_1: R54.2 XP4.2
AIN_2: R59.2 XP4.3
AIN_3: R63.2 XP4.4
ASCL: DD7.10(SCL) DD9.6(SCL) R57.2 XS2.5  [also labelled GPIO1]
ASDA: DD7.9(SDA) DD9.5(SDA) R56.2 XS2.3  [also labelled GPIO0]
AUTOMDIX_EN: DD1.41(AUTOMDIX_EN) R12.2
B: DD2.13(B) VD1.1 VD2.2 VD4.1 XP1.2 XP7.2
BAT_RTC: BAT1.1 VD16.1
CAM0_CN: XS2.144
CAM0_CP: XS2.142
CAM0_DN0: XS2.138
CAM0_DN1: XS2.150
CAM0_DP0: XS2.136
CAM0_DP1: XS2.148
CAM1_CN: XS2.149
CAM1_CP: XS2.147
CAM1_DN0: XS2.161
CAM1_DN1: XS2.155
CAM1_DN2: XS2.143
CAM1_DN3: XS2.137
CAM1_DP0: XS2.159
CAM1_DP1: XS2.153
CAM1_DP2: XS2.141
CAM1_DP3: XS2.135
CONTR_485: DD2.4(RE#) DD2.5(RTS) XS2.59  [also labelled GPIO17, RTS_485]
DIN_0: R25.2 XP4.5
DIN_1: R33.2 XP4.6
DIN_2: R35.2 XP4.7
DIN_3: R43.2 XP4.8
DINC_0: PC4.4 R24.2 XS2.46  [also labelled GPIO32]
DINC_1: PC5.4 R31.2 XS2.48  [also labelled GPIO33]
DINC_2: PC6.4 R34.2 XS2.52  [also labelled GPIO34]
DINC_3: PC7.4 R42.2 XS2.54  [also labelled GPIO35]
DIS_N: DD6.3(DIS_N) R49.2 VT1.3(D)
DIS_N_INV: VT1.1(G) XS2.45  [also labelled GPIO12]
DSI0_CN: XS2.105
DSI0_CP: XS2.107
DSI0_DN0: XS2.99
DSI0_DN1: XS2.93
DSI0_DP0: XS2.101
DSI0_DP1: XS2.95
DSI1_CN: XS2.102
DSI1_CP: XS2.100
DSI1_DN0: XS2.96
DSI1_DN1: XS2.120
DSI1_DN2: XS2.114
DSI1_DN3: XS2.108
DSI1_DP0: XS2.94
DSI1_DP1: XS2.118
DSI1_DP2: XS2.112
DSI1_DP3: XS2.106
EMMC_DISABLE_N: XS2.2
EMMC_EN_N_1V8: XS2.90
FB5V: C41.1 DD4.4(FB) R9.1 R30.2
GPIO2: XS2.9
GPIO3: XS2.11
GPIO4: XS2.15
GPIO5: XS2.17
GPIO6: XS2.21
GPIO7: XS2.23
GPIO8: DD6.4(CS_N) XS2.27  [also labelled ISO_CS_N]
GPIO9: DD6.13(SO) XS2.29  [also labelled ISO_SO]
GPIO10: DD6.6(SI) XS2.33  [also labelled ISO_SI]
GPIO11: DD6.5(SCLK) XS2.35  [also labelled ISO_SCLK]
GPIO13: DD6.14(DIAG_N) XS2.47  [also labelled ISO_DIAG_N]
GPIO14: DD2.3(DXD) XS2.51  [also labelled OUT_485]
GPIO15: DD2.6(TXD) XS2.53  [also labelled IN_485]
GPIO16: XS2.57
GPIO18: XS2.63
GPIO19: XS2.65
GPIO20: XS2.69
GPIO21: XS2.71
GPIO22: XS2.75
GPIO23: XS2.77
GPIO24: XS2.81
GPIO25: XS2.83
GPIO26: XS2.87
GPIO27: XS2.89
GPIO28: R39.1 XS2.28
GPIO29: R38.1 XS2.30
GPIO30: C63.2 R14.1 R32.2 XS2.34  [also labelled RESET]
GPIO31: R45.1 XS2.36  [also labelled GPIO_LED]
GPIO36: R48.1 XS2.58  [also labelled ON_rele_1]
GPIO37: R53.1 XS2.60  [also labelled ON_rele_2]
GPIO38: R60.1 XS2.64  [also labelled ON_rele_3]
GPIO39: R67.1 XS2.66  [also labelled ON_rele_4]
GPIO40: XS2.70
GPIO41: XS2.72
GPIO42: XS2.76
GPIO43: XS2.78
GPIO44: R47.1 XS2.82
GPIO45: R46.1 XS2.84
HDMI_CEC: XS2.171
HDMI_CK_N: XS2.111
HDMI_CK_P: XS2.113
HDMI_D0_N: XS2.117
HDMI_D0_P: XS2.119
HDMI_D1_N: XS2.123
HDMI_D1_P: XS2.125
HDMI_D2_N: XS2.129
HDMI_D2_P: XS2.131
HDMI_HPD_N_1V8: XS2.88
HDMI_SCL: XS2.175
HDMI_SDA: XS2.173
nFDX_LED_GPIO0: DD1.20(nFDX_LED/GPIO0)
nLNKA_LED_GPIO1: DD1.21(nLNKA_LED/GPIO1) R2.1
nRESET: DD1.12(n_RESET) R13.2
nSPD_LED_GPIO2: DD1.22(nSPD_LED/GPIO2) R1.1
nTRST: DD1.28(nTRST) R19.1
OSCI: BQ1.1 C25.1 DD9.1(OCSI)
OSCO: BQ1.4 DD9.2(OSCO)
out5V: C31.2 C38.2 C41.2 L4.1 L5.1 L8.2 R30.1
OUT24V_0: DD6.35(OUT0_A) DD6.36(OUT0_B) R75.1 XP6.8
OUT24V_1: DD6.33(OUT1_A) DD6.34(OUT1_B) R74.1 XP6.7
OUT24V_2: DD6.31(OUT2_A) DD6.32(OUT2_B) R73.1 XP6.6
OUT24V_3: DD6.29(OUT3_A) DD6.30(OUT3_B) R72.1 XP6.5
OUT24V_4: DD6.27(OUT4_A) DD6.28(OUT4_B) R71.1 XP6.4
OUT24V_5: DD6.25(OUT5_A) DD6.26(OUT5_B) R70.1 XP6.3
OUT24V_6: DD6.23(OUT6_A) DD6.24(OUT6_B) R69.1 XP6.2
OUT24V_7: DD6.21(OUT7_A) DD6.22(OUT7_B) R68.1 XP6.1
rele_load_1_N: OPT1.3(Load) XP5.1
rele_load_1_P: OPT1.4(Load) XP5.2
rele_load_2_N: OPT2.3(Load) XP5.3
rele_load_2_P: OPT2.4(Load) XP5.4
rele_load_3_N: OPT3.3(Load) XP5.5
rele_load_3_P: OPT3.4(Load) XP5.6
rele_load_4_N: OPT4.3(Load) XP5.7
rele_load_4_P: OPT4.4(Load) XP5.8
RUN: XP2.1 XS2.177
RX_N: DD1.53(RXN) R4.2 XS1.6 ; off-sheet RXN  [also labelled RXN]
RX_P: DD1.52(RXP) R5.2 XS1.3 ; off-sheet RXP  [also labelled RXP]
SDX_CLK: XS2.10
SDX_CMD: XS2.12
SDX_D0: XS2.16
SDX_D1: XS2.18
SDX_D2: XS2.22
SDX_D3: XS2.24
TCK: DD1.32(TCK) R23.1
TDI: DD1.30(TDI) R21.1
TDO: DD1.31(TDO)
TMS: DD1.29(TMS) R22.1
TX_N: DD1.56(TXN) R6.2 XS1.2 ; off-sheet TXN  [also labelled TXN]
TX_P: DD1.55(TXP) R7.2 XS1.1 ; off-sheet TXP  [also labelled TXP]
USB_OTGID: R65.1 XS2.168
USBD_N: DD1.58(USBDM0) XS2.167
USBD_P: DD1.59(USBDP0) XS2.165
VC_TCK: XP2.8 XS2.180
VC_TDI: XP2.3 XS2.174
VC_TDO: XP2.5 XS2.178
VC_TMS: XP2.6 XS2.176
VC_TRST_N: XS2.172
VDD18CORE: C16.2 C17.2 C18.2 DD1.15(VDD18CORE) DD1.38(VDD18CORE)
VDD18ETHPLL: C19.2 DD1.48(VDD18ETHPLL) L2.2
VDD18USBPLL: C20.2 DD1.62(VDD18USBPLL) L2.1
VDD_CORE: XS2.179
VDD_RTC: C22.2 DD9.8(VDD) VD16.3
XI: BQ2.1 C23.2 DD1.61(XI) R17.1
XO: BQ2.2 C24.2 DD1.60(XO) R17.2
NetC21_2: C21.2 R8.2 XS1.4 XS1.5
NetC26_1: C26.1 L3.2 TR1.4(+V_in)
NetC27_1: C27.1 C28.1 DA1.3(V_IN) TR1.5(+V_out)
NetC35_1: C35.1 C37.2 DD4.1(VIN) L7.2 VD6.1
NetC59_2: C59.2 DD7.5(AIN1) R55.1 VD13.2
NetC60_2: C60.2 DD7.6(AIN2) R61.1 VD14.2
NetC61_2: C61.2 DD7.7(AIN3) R64.1 VD15.2
NetC64_2: C64.2 DD7.4(AIN0) R51.1 VD12.2
NetDD1_50: DD1.50(EXRES) R10.2
NetDD1_63: DD1.63(USBRBIAS) R3.2
NetDD4_2: DD4.2(OUT) L8.1 VD7.1
NetLED1_1: LED1.1 R44.2
NetLED2_1: LED2.1 R45.2
NetLED3_1: LED3.1(ANODE) R68.2
NetLED4_1: LED4.1(ANODE) R69.2
NetLED5_1: LED5.1(ANODE) R70.2
NetLED6_1: LED6.1(ANODE) R71.2
NetLED7_1: LED7.1(ANODE) R72.2
NetLED8_1: LED8.1(ANODE) R73.2
NetLED9_1: LED9.1(ANODE) R74.2
NetLED10_1: LED10.1(ANODE) R75.2
NetOPT1_1: OPT1.1(+) R48.2
NetOPT2_1: OPT2.1(+) R53.2
NetOPT3_1: OPT3.1(+) R60.2
NetOPT4_1: OPT4.1(+) R67.2
NetPC4_1: PC4.1 R25.1 VD5.2
NetPC5_1: PC5.1 R33.1 VD8.2
NetPC6_1: PC6.1 R35.1 VD9.2
NetPC7_1: PC7.1 R43.1 VD10.2
NetR1_2: R1.2 XS1.11
NetR2_2: R2.2 XS1.10
NetR16_2: R16.2 XP7.1
NetR32_1: R32.1 SW1.1
NetR50_1: R50.1 R51.2 R52.1
NetR54_1: R54.1 R55.2 R58.1
NetR59_1: R59.1 R61.2 R62.1
NetR63_1: R63.1 R64.2 R66.1

Not connected (* = marked no-connect by the designer): DD1 1(USBDM2) 2(USBDP2) 3(USBDM3) 4(USBDP3) 6(NC) 7(NC) 8(NC) 9(NC) 13(TEST1) 14(PRTCTL2) 16(PRTCTL3) 17(NC) 18(NC) 23(EECLK) 24(EECS) 25(EEDO) 26(EEDI) 35(GPIO3) 36(GPIO4) 37(GPIO5) 42(GPIO6) 43(GPIO7) 45(CLK24_OUT) 47(TEST4); DD2 10(DE) 11(NC) 14(NC); DD6 1(NC1) 7(NC2) 8(NC3) 9(NC4) 10(NC5) 11(NC6) 12(NC7) 16(NC8) 17(NC9) 18(NC10) 20(NC11); DD7 2(ALERT); DD9 3(INT#) 7(CLKOUT); XP2 2 9; XS1 8(SHIELD) 113 114 115 116 117 118 119 120 121; XS2 124 126 128 130 132 154 156 158 160 162 164 166

## Layout directives
differential pair: RX_N, RX_P, TX_N, TX_P, USBD_N, USBD_P

## Notes on the sheet
- RTC
- Ethernet
- RS-485
- Speed max 20Mb
- connector for JTAG
- (near XP2) JTAG
- Isolated 4 Channel Digital Input
- DC/DC 3.3V
- Power supply to power the processor,  Input voltage 12-24V, Output voltage 5V.
- DDR2 SODIMM CONNECTOR FOR_CM module
- DC/DC 1.8V
- LEDs
- GPIO 28, 29, 44, 45 DO NOT
  HAVE PULLS ENABLED AT BOOT
  SO PROVIDE 100K PULL DOWNS
  TO AVOID THEM FLOATING
- Galvanic Isolated 8 Channel 1.2A High-Side Switch
- Analog to Digital Converter. 4-20mA
- solid state relays. Switching current 100 mA to 100V
- I2C address 1001000 (48 hex, 72 dec)
- Labels drawn without touching a wire or pin: GPIO_LED, VC_TRST_N
- Title
- Size:
- Date:
- File:
- A0
- Number:
- Time:
- Revision:
- Sheet
- of
- (in symbol CPC1016N) MOSFET
- (in symbol HR911105A) YELLOW; RIGHT; GREEN; LEFT; TRANSMIT 1:1; TX+; PWR; TX-; RECEIVE 1:1; RX+; RX-; 75; 7; 1000pF 2KV
- (in symbol KX-327LT) 32.768 kHz
- (in symbol LAN9512_QFN64 (Customer)) Power; Upstream; Downstream; EEPROM; Ethernet; GPIO + Misc.; Clocks; JTAG+ No Connects

## Library data of the parts
BAT1 = BAT_HOLD_CR2032: BAT_HOLD_1xCR2032
BQ1 = KX-327LT: CRYSTAL  32.7680 kHz  QSMD 7.0x1.5x1.4mm
BQ2 = NX3225HA-25MHZ: CRYSTAL 25MHZ, 3.5pF, 30PPM, 3.2x2.5mm
C1 C15 C16 C20 C26-C30 C32-C34 C46 C48-C50 C56 C66 = GRM21BR61C106KE15: C0805, 10uF 10%, 16V, X5R; Manufacturer: Murata Electronics North America; Applications: General Purpose; Category: Capacitors; Operating Temperature: -55°C ~ 85°C; Package / Case: 0805 (2012 Metric); Size / Dimension: 0.079" L x 0.049" W (2.00mm x 1.25mm); Temperature Coefficient: X5R; Tolerance: ±10%; ComponentLink1URL: http://search.murata.co.jp/Ceramy/image/img/PDF/ENG/GRM21BR61C106KE15.pdf; ComponentLink1Description: http://search.murata.co.jp/Ceramy/image/img/PDF/ENG/GRM21BR61C106KE15.pdf; Pricing: 1=0.3, 10=0.25, 50=0.1408, 100=0.1252, 250=0.09392, 500=0.08294, 1000=0.07356 (USD); Voltage - Rated: 16V
C2-C14 C17-C19 C21 C22 C31 C42 C55 C58-C65 = GRM155R71C104KA88: C0402, 100nF,  16V, X7R; Manufacturer: MURATA; Manufacturer Part Number: GRM155R71C104KA88D; Capacitance Tolerance: ± 10%; Dielectric Characteristic: X7; Voltage Rating: 16; Capacitor Case Style: 0402 [1005 Metric]; Capacitor Terminals: SMD; SVHC: No SVHC (19-Dec-2012); No. of Pins: 2; Reel Quantity: 10000; Tolerance +: 10%; Supplier 1: Farnell; Supplier Part Number 1: 1118151; RoHS: YES; Stock: 3; Pricing: 10000=0.008593, 30000=0.007991 (GBP); Operating Temperature Min: -55; Operating Temperature Max: 125; Operating Temperature Range: -55°C to +125; Package / Case: 0402; Packaging: Reel; Series: GRM Hi-Cap; Terminal Type: Surface Mount (SMD, SMT); Tolerance -: 10%; Voltage Rating V DC: 16; ComponentLink1URL: http://www.farnell.com/datasheets/4360.pdf; ComponentLink1Description: http://www.farnell.com/datasheets/4360.pdf
C23 C24 = C0402, 33pF, 50V, C0G: Manufacturer: MURATA; Manufacturer Part Number: GRM155R71C104KA88D; Capacitance Tolerance: ± 10%; Dielectric Characteristic: X7; Voltage Rating: 16; Capacitor Case Style: 0402 [1005 Metric]; Capacitor Terminals: SMD; SVHC: No SVHC (19-Dec-2012); No. of Pins: 2; Reel Quantity: 10000; Tolerance +: 10%; Supplier 1: Farnell; Supplier Part Number 1: 1118151; RoHS: YES; Stock: 3; Pricing: 10000=0.008593, 30000=0.007991 (GBP); Operating Temperature Min: -55; Operating Temperature Max: 125; Operating Temperature Range: -55°C to +125; Package / Case: 0402; Packaging: Reel; Series: GRM Hi-Cap; Terminal Type: Surface Mount (SMD, SMT); Tolerance -: 10%; Voltage Rating V DC: 16; ComponentLink1URL: http://www.farnell.com/datasheets/4360.pdf; ComponentLink1Description: http://www.farnell.com/datasheets/4360.pdf
C25 = C0402, 6.8pF,  50V, C0G: Manufacturer Part Number: GRM1555C1H680JZ01D; Manufacturer: Murata Electronics North America; Temperature Coefficient: C0G, NP0; Tolerance: ±5%; Height - Seated (Max): -; Thickness (Max): 0.022" (0.55mm); Package / Case: 0402 (1005 Metric); Category: Capacitors; Operating Temperature: -55°C ~ 125°C; Size / Dimension: 0.039" L x 0.020" W (1.00mm x 0.50mm); Lead Spacing: -; RoHS: RoHS Compliant; Mounting Type: Surface Mount, MLCC; Voltage - Rated: 50V; Supplier Part Number: 490-1289-1-ND; Applications: General Purpose; Ratings: -; Supplier: Digi-Key; Packaging: Cut Tape (CT); Lead Style: -; Features: -; ComponentLink1URL: http://search.murata.co.jp/Ceramy/image/img/PDF/ENG/GRM1555C1H680JZ01.pdf; ComponentLink1Description: http://search.murata.co.jp/Ceramy/image/img/PDF/ENG/GRM1555C1H680JZ01.pdf; Pricing: 1=0.1, 10=0.035, 50=0.0188, 100=0.016, 250=0.01304, 500=0.01116, 1000=0.0087, 5000=0.00725 (USD); Supplier 1: Digi-Key; Supplier Part Number 1: 490-1289-1-ND
C35 C40 C54 C57 = C1206C104K5RAC7800: C1206, 0.1uF 10%, 50V, X7R; Manufacturer: Murata Electronics North America; Temperature Coefficient: X5R; Applications: General Purpose; Category: Capacitors; Operating Temperature: -55°C ~ 85°C; Package / Case: 0805 (2012 Metric); Size / Dimension: 0.079" L x 0.049" W (2.00mm x 1.25mm); Tolerance: ±10%; ComponentLink1URL: http://search.murata.co.jp/Ceramy/image/img/PDF/ENG/GRM21BR61C106KE15.pdf; ComponentLink1Description: http://search.murata.co.jp/Ceramy/image/img/PDF/ENG/GRM21BR61C106KE15.pdf; Pricing: 1=0.3, 10=0.25, 50=0.1408, 100=0.1252, 250=0.09392, 500=0.08294, 1000=0.07356 (USD)
C36-C39 C53 = CA050M0220REG-1010: Capacitor Aluminium 220uF 50V   SMD1010; 220uF 50V: 220uF 50V
C41 = GRM155R71E682KA01: C0402, 6.8nF 5%,  25V, X7R
DA1 = SPX1117M3-L-5-0/TR: IC REG LDO 0.8A 5V SOT223-4
DD1 = LAN9512_QFN64 (Customer): Ethernet Bridge, USB to Ethernet USB 2.0, 10/100 Base-T/TX PHY USB Interface 64-QFN (9x9); PART#: LAN9512; RoHS: RoHS
DD2 = ADM2486BRWZ: RS422, RS485 Digital Isolator 2500Vrms 3 Channel 20Mbps 25kV/µs CMTI 16-SOIC (0.295", 7.50mm Width)
DD4 = LM2596DSADJR4G: Buck, Boost, Buck-Boost Switching Regulator IC Positive or Negative Adjustable 1.23V 1 Output 3A TO-263-6, D²Pak (5 Leads + Tab), TO-263BA
DD6 = ISO1H816G_1: Galvanic Isolated 8 Channel 1.2A High-Side Switch; Manufacturer: Infineon Technologies; ManufacturerPartNumber: ISO1H816G; PackageReference: PG-DSO-36
DD7 = ADS1115IDGS: 16 Bit Analog to Digital Converter 2, 4 Input 1 Sigma-Delta 10-VSSOP
DD8 = MAX809SD: IC SUPERVISOR, RESET THRESHOLD 2.93V
DD9 = PCF8563T: Real-Time Clock (RTC) and calendar
DD10 = SPX1117M3-L-3-3/TR: IC REG LDO 0.8A 3.3V SOT223-4
DD11 = SPX1117M3-L-1-8/TR: IC REG LDO 0.8A 1.8V SOT223-4
L1-L5 L7 L9 = BLM18PG121SN1D: FILTER BLM18 (0603, 2A); Manufacturer: MURATA; DC Resistance Max: 0.05; Impedance: 120; Ferrite Mounting: SMD; Inductor Type: Ferrite Bead; SVHC: No SVHC (19-Dec-2011); Ferrite Case Style: 0603 / 1608; Core Material: Ferrite; DC Current Max: 2000; Inductor Case Style: 0603; Inductance Tolerance: ± 25%; No. of Pins: 2; RoHS: YES; Operating Temperature Min: -55; Mounting Type: SMD; Operating Temperature Max: +125; Package / Case: 0603; Impedance @ 100MHz Typ: 120; Resistance: 0.05; Supplier Part Number: 1515738; Supplier: Farnell; ComponentLink1URL: http://www.farnell.com/datasheets/5148.pdf; ComponentLink1Description: http://www.farnell.com/datasheets/5148.pdf; Pricing: 5=0.056, 50=0.041, 100=0.034, 250=0.028, 500=0.027 (GBP); Manufacturer Part Number: BLM18PG121SN1D; DC Current Rating: 2A
L8 = SRR1208-330YL: 33µH Shielded Wirewound Inductor 2.8A 62 mOhm Max Nonstandard
LED1 LED2 = WP934CB/GD: LED Green 3mm. Right Angle LED Indicator
LED3-LED10 = LED, SMT, 0603: LED, SMT, 0603, Generic; Size: 1608; Manuf. Part No: Generic; Manufacturer: Generic
OPT1-OPT4 = CPC1016N: Single-Pole, Normally Open  4-Lead SOP OptoMOS Relay
PC4-PC7 = TLP291GB: Photocoupler TLP291
R1 R2 R44 R45 = R0402_332R: RES, 0402, 332R 1%,; Tolerance: 1%
R3 = R0402_12K: RES, 0402, 12K 1%,; Tolerance: 1%
R4-R7 = R0402_49.9R: RES, 0402, 49.9R 1%,; Tolerance: 1%
R8 = R0402_10R: RES, 0402, 10R 1%,; Tolerance: 1%
R9 R32 = R0402_1K: RES, 0402, 1K 1%,; Tolerance: 1%
R10 = R0402_12.4K: RES, 0402, 12.4K 1%,; Tolerance: 1%
R12 R13 R19 R21-R23 R49 R68-R75 = R0402_10K: RES, 0402, 10K 1%,; Tolerance: 1%
R14 R38 R39 R46 R47 = R0402_100K: RES, 0402, 100K 1%,; Tolerance: 1%
R16 = R0402_120R: RES, 0402, 120R 1%,; Tolerance: 1%
R17 = R0402_1M: RES, 0402, 1M; Tolerance: 1%
R24 R31 R34 R42 R56 R57 = R0402_4,75k: RES, 0402, 4.75K 1%,; Tolerance: 1%
R25 R33 R35 R43 = R0805_4,7K: RES, 0805, 4.7K; Tolerance: 1%
R30 R51 R55 R61 R64 = R0402_3,01K: RES, 0402, 3.01K 1%,; Tolerance: 1%
R48 R53 R60 R67 = R0402_2,37K_1: RES, 0402, 2.37K 1%,; Tolerance: 1%
R50 R54 R59 R63 = R0402_49,9R: RES, 0402, 49.9R 1%,; Tolerance: 1%
R52 R58 R62 R66 = R0402_100R: RES, 0402, 100R 1%,; Tolerance: 1%
R65 = R0402_1,05K: RES, 0402, 1.05K 1%,; Tolerance: 1%
SW1 = IT-1188E (6x3x3.5): Horizontal Push Tact Switch
TR1 = AM1P-0512DZ: DC/DC IN5V OUT12V 42mA Isolation 1kV
VD1-VD4 = ESD9L5.0ST5G: TVS DIODE 5VWM 9.8VC SOD923
VD5 VD8-VD10 VD12-VD15 = PESD3V3S1UB: TVS DIODE 3.3V  SOD523
VD6 VD11 = SMBJ24CA: DIODE TVS 24V, 600W
VD7 = SK34: Diode Schottky 40V 3A Surface Mount, SMC
VD16 = BAV70: High-speed switching diodes 200mA 100V SOT23
VT1 = BSS138LT1G: MOSFET N-CH 50V 0.2A SOT23
XP1 = 15EDGRC-2.5-03P-14-00A
XP2 = PLD-10: Connector PLD-10
XP3 = 2EDGRM-5.08-02P-14-00A
XP4-XP6 = 15EDGRC-3.5-08P-14-00AH: Connector 15EDGRC-3.5-08P-14-00AH + 15EDGK-3.5-08P-14-00AH
XP7 = PLS-2: Connector PLS-2 (2.54mm x1)
XS1 = HR911105A: Single Port RJ45 connector with magnetics module and LED
XS2 = CON_200W_DDR2SODIMM_CM: DDR2 SODIMM